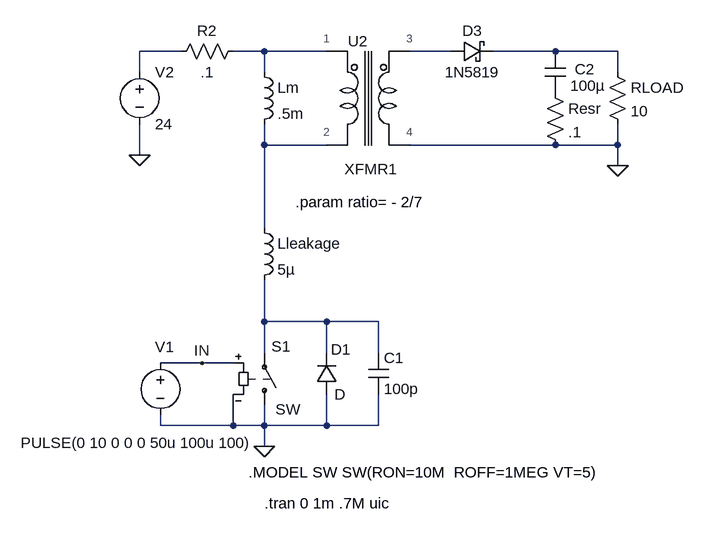
[diagram p0: schematic flyback_s.asc]
flyback_s.asc, the LTspice schematic file:
Version 4
SHEET 1 968 1192
WIRE -64 480 -128 480
WIRE 64 480 16 480
WIRE 160 480 64 480
WIRE 352 480 288 480
WIRE 512 480 416 480
WIRE 608 480 512 480
WIRE -128 512 -128 480
WIRE 64 512 64 480
WIRE 608 512 608 480
WIRE 64 624 64 592
WIRE 160 624 64 624
WIRE 512 624 288 624
WIRE 608 624 608 592
WIRE 608 624 512 624
WIRE -128 640 -128 592
WIRE 608 656 608 624
WIRE 64 752 64 624
WIRE 64 896 64 832
WIRE 160 896 64 896
WIRE 240 896 160 896
WIRE 64 944 64 896
WIRE 160 944 160 896
WIRE 240 944 240 896
WIRE -32 960 -96 960
WIRE 16 960 -32 960
WIRE -96 1056 -96 1040
WIRE 16 1056 16 1008
WIRE 16 1056 -96 1056
WIRE 64 1056 64 1024
WIRE 64 1056 16 1056
WIRE 160 1056 160 1008
WIRE 160 1056 64 1056
WIRE 240 1056 240 1008
WIRE 240 1056 160 1056
WIRE 64 1088 64 1056
FLAG -32 960 IN
FLAG 608 656 0
FLAG 64 1088 0
FLAG -128 640 0
SYMBOL voltage -96 944 R0
WINDOW 123 0 0 Left 0
WINDOW 39 0 0 Left 0
WINDOW 0 -8 -9 Left 0
WINDOW 3 -215 139 Left 0
SYMATTR InstName V1
SYMATTR Value PULSE(0 10 0 0 0 50u 100u 100)
SYMBOL Misc\\XFMR1 176 640 R0
SYMATTR InstName U2
SYMBOL ind 48 736 R0
SYMATTR InstName Lleakage
SYMATTR Value 5µ
SYMBOL ind 48 496 R0
SYMATTR InstName Lm
SYMATTR Value .5m
SYMBOL sw 64 1040 M180
WINDOW 0 11 106 Left 0
WINDOW 3 17 9 Left 0
SYMATTR InstName S1
SYMBOL diode 176 1008 R180
WINDOW 0 -21 69 Left 0
WINDOW 3 -13 0 Left 0
SYMATTR InstName D1
SYMBOL cap 224 944 R0
SYMATTR InstName C1
SYMATTR Value 100p
SYMBOL voltage -128 496 R0
WINDOW 123 0 0 Left 0
WINDOW 39 0 0 Left 0
SYMATTR InstName V2
SYMATTR Value 24
SYMBOL cap 496 480 R0
WINDOW 0 46 27 Left 0
WINDOW 3 39 53 Left 0
SYMATTR InstName C2
SYMATTR Value 100µ
SYMBOL res 592 496 R0
SYMATTR InstName RLOAD
SYMATTR Value 10
SYMBOL res 32 464 R90
WINDOW 0 0 56 VBottom 0
WINDOW 3 32 56 VTop 0
SYMATTR InstName R2
SYMATTR Value .1
SYMBOL schottky 352 496 R270
WINDOW 0 32 32 VTop 0
WINDOW 3 0 32 VBottom 0
SYMATTR InstName D3
SYMATTR Value 1N5819
SYMATTR Description Diode
SYMATTR Type diode
SYMBOL res 496 528 R0
SYMATTR InstName Resr
SYMATTR Value .1
TEXT 64 1176 Left 0 !.tran 0 1m .7M uic
TEXT 112 712 Left 0 !.param ratio= - 2/7
TEXT 40 1128 Left 0 !.MODEL SW SW(RON=10M  ROFF=1MEG VT=5)

The netlist it stands for:
* flyback_s.asc
V1 IN 0 PULSE(0 10 0 0 0 50u 100u 100)
XU2 N002 N005 N003 0 XFMR1  ; pins 1 2 3 4
Lleakage N005 N006 5µ
Lm N002 N005 .5m
S1 0 N006 IN 0 SW
D1 0 N006 D
C1 N006 0 100p
V2 N001 0 24
C2 N004 P001 100µ
RLOAD N004 0 10
R2 N002 N001 .1
D3 N003 N004 1N5819
Resr P001 0 .1
.model D D
.lib standard.dio
.tran 0 1m .7M uic
.param ratio= - 2/7
.MODEL SW SW(RON=10M  ROFF=1MEG VT=5)
.lib ..\sym\misc\XFMR.LIB
.backanno
.end